# Altium schematic sheet DisplaySupplies.SchDoc
size 431 x 279 mm; Organization: ORGANIZATION; Address1: ADDRESS 1; Address2: ADDRESS 2; Address3: ADDRESS 3; Address4: ADDRESS 4; Revision: -; SheetNumber: 4; SheetTotal: 5; ENG_APP_DATE: --/--/--; DSN_APP_DATE: --/--/--; CHK_APP_DATE: --/--/--
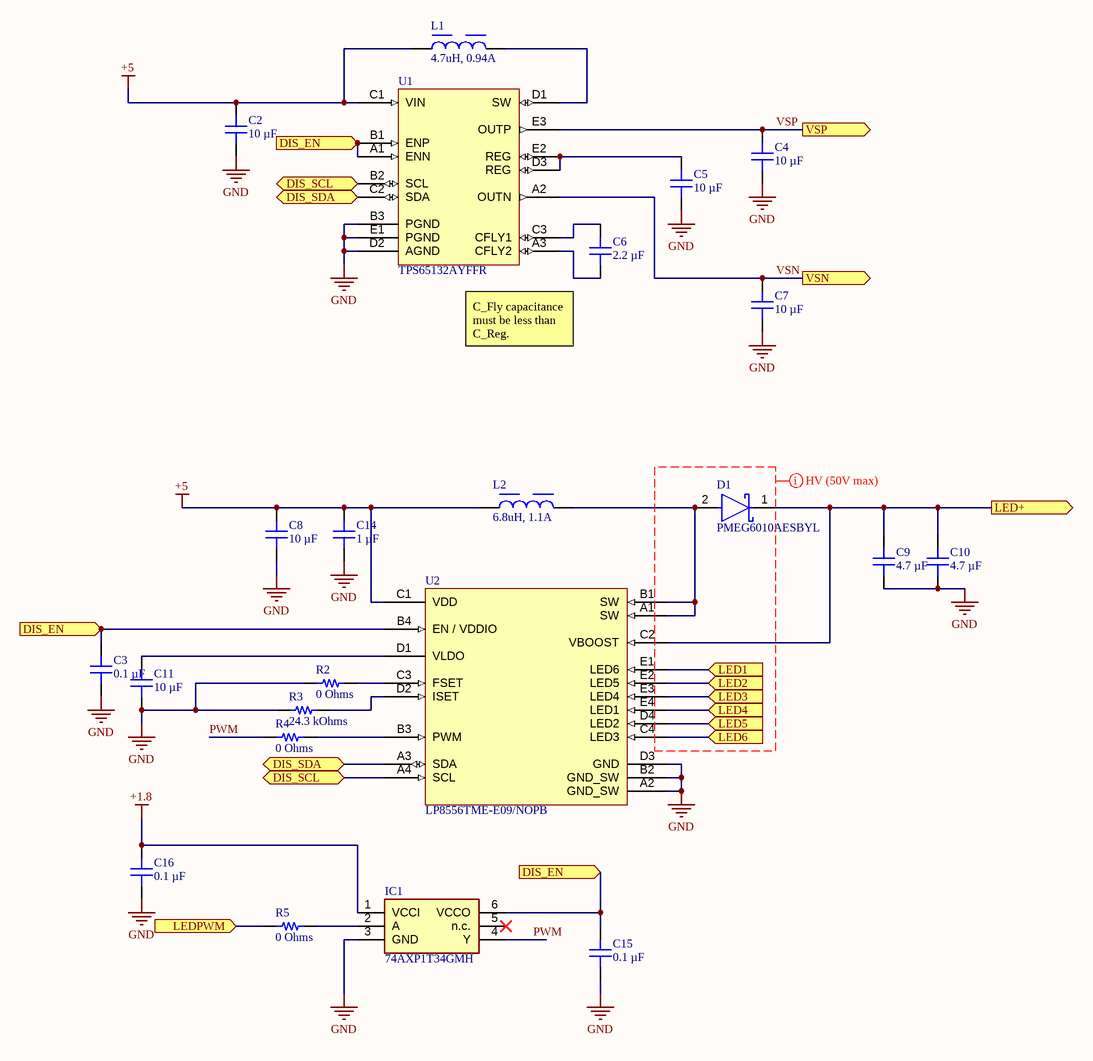
[diagram p0: DisplaySupplies.SchDoc]

## Parts
C2  10 µF  [CAP 0603_1608]
C3  0.1 µF  [CAP 0201_0603]
C4  10 µF  [CAP 0603_1608]
C5  10 µF  [CAP 0603_1608]
C6  2.2 µF  [CAP 0402_1005]
C7  10 µF  [CAP 0603_1608]
C8  10 µF  [CAP 0603_1608]
C9  4.7 µF  [CAP 1206_3216 - 0.8MM]
C10  4.7 µF  [CAP 1206_3216 - 0.8MM]
C11  10 µF  [CAP 0603_1608]
C14  1 µF  [CAP 0402_1005]
C15  0.1 µF  [CAP 0201_0603]
C16  0.1 µF  [CAP 0201_0603]
D1  PMEG6010AESBYL  [FP-SOD993-MFG]
IC1  74AXP1T34GMH  [PESD3V3L5UF115]
L1  4.7uH, 0.94A  [WE-MAPI_2510]
L2  6.8uH, 1.1A  [WE-MAPI_3015]
R2  0 Ohms  [RES 0402_1005]
R3  24.3 kOhms  [RES 0402_1005]
R4  0 Ohms  [RES 0402_1005]
R5  0 Ohms  [RES 0402_1005]
U1  TPS65132AYFFR  [BGA15C40P3X5_151X211X62]
U2  LP8556TME-E09/NOPB  [BGA20C40P4X5_171X237X68]

## Ports
DIS_EN (in), DIS_SCL (bidir), DIS_SDA (bidir), LED1 (in), LED2 (in), LED3 (in), LED4 (in), LED5 (in), LED6 (in), LED+ (out), LEDPWM (in), VSN (out), VSP (out)

## Nets
+1.8: C16.2 IC1.1(VCCI)
+5: C2.2 C8.2 C14.2 L1.1 L2.1 U1.C1(VIN) U2.C1(VDD)
GND: C2.1 C3.1 C4.1 C5.1 C7.1 C8.1 C9.1 C10.1 C11.1 C14.1 C15.1 C16.1 IC1.3(GND) R2.2 R3.2 U1.B3(PGND) U1.D2(AGND) U1.E1(PGND) U2.A2(GND_SW) U2.B2(GND_SW) U2.D3(GND)
DIS_EN: C3.2 C15.2 IC1.6(VCCO) U1.A1(ENN) U1.B1(ENP) U2.B4(EN_/_VDDIO) ; port DIS_EN
DIS_SCL: U1.B2(SCL) U2.A4(SCL) ; port DIS_SCL
DIS_SDA: U1.C2(SDA) U2.A3(SDA) ; port DIS_SDA
LED1: U2.E1(LED6) ; port LED1
LED2: U2.E2(LED5) ; port LED2
LED3: U2.E3(LED4) ; port LED3
LED4: U2.E4(LED1) ; port LED4
LED5: U2.D4(LED2) ; port LED5
LED6: U2.C4(LED3) ; port LED6
LED+: C9.2 C10.2 D1.1(K) U2.C2(VBOOST) ; port LED+
LEDPWM: R5.2 ; port LEDPWM
PWM: IC1.4(Y) R4.2
VSN: C7.2 U1.A2(OUTN) ; port VSN
VSP: C4.2 U1.E3(OUTP) ; port VSP
NetC5_2: C5.2 U1.D3(REG) U1.E2(REG)
NetC6_1: C6.1 U1.A3(CFLY2)
NetC6_2: C6.2 U1.C3(CFLY1)
NetC11_2: C11.2 U2.D1(VLDO)
NetD1_2: D1.2(A) L2.2 U2.A1(SW) U2.B1(SW)
NetIC1_2: IC1.2(A) R5.1
NetL1_2: L1.2 U1.D1(SW)
NetR2_1: R2.1 U2.C3(FSET)
NetR3_1: R3.1 U2.D2(ISET)
NetR4_1: R4.1 U2.B3(PWM)

Not connected (* = marked no-connect by the designer): IC1 5(n.c.)*

## Layout directives
net class HV: (no net found under the mark)

## Notes on the sheet
- C_Fly capacitance must be less than C_Reg.
- DWG. NO.
- REV.
- SHT.
- REVISION
- DESCRIPTION
- DATE
- APPROVED
- ENG:
- APPROVALS
- PROJECT
- DSN:
- CHK:
- REFERENCE DOCUMENTS
- PROJECT REVISION:
- TITLE
- SimulaVR
- DOCUMENT REVISION:
- DESIGN ITEM:
- BOM:
- FAB DWG:
- PCB DWG:
- ASSY DWG:
- SCALE:
- SIZE
- B
- CAGE CODE
- FILE NAME
- DWG NO.
- SHEET
- OF
- REV

## Library data of the parts
C2 C4 C5 C7 C8 C11 = GRM188R61C106MA73D: CAP CER 10UF 16V X5R 0603; manufacturer: Murata Electronics; Tolerance: ±20%; Part Number: GRM188R61C106MA73D; Value: 10 µF; Applications: General Purpose; Capacitance: 10 µF; componentlink1description: Datasheet; componentlink1url: https://www.murata.com/~/media/webrenewal/support/library/catalog/products/capacitor/mlcc/c02e.ashx?la=en-us; componentlink2description: DigiKey Link; componentlink2url: https://www.digikey.com/en/products/detail/murata-electronics/GRM188R61C106MA73D/3900480; Device Package: 0603 (1608 Metric); lastupdated: 2022-04-02 05:55:00; Lifecycle Status: Active; Minimum Order: 1; Mounting Type: Surface Mount, MLCC; Operating Temperature: -55°C ~ 85°C; Package / Case: 0603 (1608 Metric); packaging: TapeAndReel; partid: 15141; Part Status: Active; price: 0.04; series: GRM; Size / Dimension: 0.063" L x 0.031" W (1.60mm x 0.80mm); Supplier 1: DigiKey; Supplier Part Number 1: 490-7201-1-ND; Temperature Coefficient: X5R; Thickness (Max): 0.039" (1.00mm); Voltage - Rated: 16V
C3 C15 C16 = GRM033R61A104KE15D: CAP CER 0.1UF 10V X5R 0201; manufacturer: Murata Electronics; Tolerance: ±10%; Part Number: GRM033R61A104KE15D; Value: 0.1 µF; Applications: General Purpose; Capacitance: 0.1 µF; componentlink1description: Datasheet; componentlink1url: https://www.murata.com/~/media/webrenewal/support/library/catalog/products/capacitor/mlcc/c02e.ashx?la=en-us; componentlink2description: DigiKey Link; componentlink2url: https://www.digikey.com/en/products/detail/murata-electronics/GRM033R61A104KE15D/2269163; Device Package: 0201 (0603 Metric); lastupdated: 2022-04-12 22:01:55; Lifecycle Status: Active; Minimum Order: 1; Mounting Type: Surface Mount, MLCC; Operating Temperature: -55°C ~ 85°C; Package / Case: 0201 (0603 Metric); packaging: CutTape; partid: 1641; Part Status: Active; price: 0.01; series: GRM; Size / Dimension: 0.024" L x 0.012" W (0.60mm x 0.30mm); Supplier 1: DigiKey; Supplier Part Number 1: 490-5881-1-ND; Temperature Coefficient: X5R; Thickness (Max): 0.013" (0.33mm); Voltage - Rated: 10V
C6 = GRM155R61C225ME44D: CAP CER 2.2UF 16V X5R 0402; manufacturer: Murata Electronics; Tolerance: ±20%; Part Number: GRM155R61C225ME44D; Value: 2.2 µF; Applications: General Purpose; Capacitance: 2.2 µF; componentlink1description: Datasheet; componentlink1url: https://search.murata.co.jp/Ceramy/image/img/A01X/G101/ENG/GRM155R61C225ME44-01.pdf; componentlink2description: DigiKey Link; componentlink2url: https://www.digikey.com/en/products/detail/murata-electronics/GRM155R61C225ME44D/5027541; Device Package: 0402 (1005 Metric); lastupdated: 2022-04-02 05:51:52; Lifecycle Status: Active; Minimum Order: 1; Mounting Type: Surface Mount, MLCC; Operating Temperature: -55°C ~ 85°C; Package / Case: 0402 (1005 Metric); packaging: TapeAndReel; partid: 4092; Part Status: Active; price: 0.03; series: GRM; Size / Dimension: 0.039" L x 0.020" W (1.00mm x 0.50mm); Supplier 1: DigiKey; Supplier Part Number 1: 490-10456-1-ND; Temperature Coefficient: X5R; Thickness (Max): 0.024" (0.60mm); Voltage - Rated: 16V
C9 C10 = GRM31CR71H475KA12L: CAP CER 4.7UF 50V X7R 1206; manufacturer: Murata Electronics; Tolerance: ±10%; Part Number: GRM31CR71H475KA12L; Value: 4.7 µF; Applications: General Purpose; Capacitance: 4.7 µF; componentlink1description: Datasheet; componentlink1url: https://www.murata.com/~/media/webrenewal/support/library/catalog/products/capacitor/mlcc/c02e.ashx?la=en-us; componentlink2description: DigiKey Link; componentlink2url: https://www.digikey.com/en/products/detail/murata-electronics/GRM31CR71H475KA12L/2548209; Device Package: 1206 (3216 Metric); lastupdated: 2022-04-02 06:00:47; Lifecycle Status: Active; Minimum Order: 1; Mounting Type: Surface Mount, MLCC; Operating Temperature: -55°C ~ 125°C; Package / Case: 1206 (3216 Metric); packaging: TapeAndReel; partid: 20010; Part Status: Active; price: 0.08; series: GRM; Size / Dimension: 0.126" L x 0.063" W (3.20mm x 1.60mm); Supplier 1: DigiKey; Supplier Part Number 1: 490-6521-1-ND; Temperature Coefficient: X7R; Thickness (Max): 0.071" (1.80mm); Voltage - Rated: 50V
C14 = GRM155R61C105MA12D: CAP CER 1UF 16V X5R 0402; manufacturer: Murata Electronics; Tolerance: ±20%; Part Number: GRM155R61C105MA12D; Value: 1 µF; Applications: General Purpose; Capacitance: 1 µF; componentlink1description: Datasheet; componentlink1url: https://search.murata.co.jp/Ceramy/image/img/A01X/G101/ENG/GRM155R61C105MA12-01.pdf; componentlink2description: DigiKey Link; componentlink2url: https://www.digikey.com/en/products/detail/murata-electronics/GRM155R61C105MA12D/4905131; Device Package: 0402 (1005 Metric); lastupdated: 2022-04-02 05:51:33; Lifecycle Status: Active; Minimum Order: 1; Mounting Type: Surface Mount, MLCC; Operating Temperature: -55°C ~ 85°C; Package / Case: 0402 (1005 Metric); packaging: TapeAndReel; partid: 10295; Part Status: Active; price: 0.01; series: GRM; Size / Dimension: 0.039" L x 0.020" W (1.00mm x 0.50mm); Supplier 1: DigiKey; Supplier Part Number 1: 490-14599-1-ND; Temperature Coefficient: X5R; Thickness (Max): 0.022" (0.55mm); Voltage - Rated: 16V
D1 = CMP-14398-000012-1: DIODE SCHOTTKY 60V 1A DSN1006-2
IC1 = 74AXP1T34GMH: Integrated Circuit; Manufacturer_Name: Nexperia; Datasheet Link: https://assets.nexperia.com/documents/data-sheet/74AXP1T34.pdf; Height: 0.5mm; Manufacturer_Part_Number: 74AXP1T34GMH; Mouser Part Number: 771-74AXP1T34GMH; Mouser Price/Stock: https://www.mouser.co.uk/ProductDetail/Nexperia/74AXP1T34GMH?qs=64Y9EYqwa9hz4MxtKQGkpQ%3D%3D; Arrow Part Number: 74AXP1T34GMH; Arrow Price/Stock: https://www.arrow.com/en/products/74axp1t34gmh/nexperia
L1 = 74438323047: WE-MAPI SMT Power Inductor, size 2510, 4.7uH, 0.94A; Manufacturer: Wurth Elektronik; DC Resistance typ.: 338mOhm; DC Resistance max.: 388mOhm; Self Resonant Frequency: 35MHz; Saturation Current: 1.75A; ComponentLink1Description: Manufacturer; ComponentLink1URL: http://www.we-online.de; ComponentLink2Description: Datasheet; ComponentLink2URL: https://www.we-online.com/catalog/datasheet/74438323047.pdf; Mounting Technology: SMT; Operating Temperature: -40 to +125degC; Packaging: Tape and Reel; Size: 2510; Inductance: 4.7uH; Manufacturer Part Number: 74438323047; Rated Current: 0.94A; Height: 1mm; Length: 2.5mm; Width: 2mm
L2 = 74438335068: WE-MAPI SMT Power Inductor, size 3015, 6.8uH, 1.1A; Manufacturer: Wurth Elektronik; DC Resistance typ.: 250mOhm; DC Resistance max.: 287mOhm; Self Resonant Frequency: 25MHz; Saturation Current: 2.4A; ComponentLink1Description: Manufacturer; ComponentLink1URL: http://www.we-online.de; ComponentLink2Description: Datasheet; ComponentLink2URL: https://www.we-online.com/catalog/datasheet/74438335068.pdf; Mounting Technology: SMT; Operating Temperature: -40 to +125degC; Packaging: Tape and Reel; Size: 3015; Inductance: 6.8uH; Manufacturer Part Number: 74438335068; Rated Current: 1.1A; Height: 1.5mm; Length: 3mm; Width: 3mm
R2 R4 R5 = CRCW04020000Z0EDHP: RES SMD 0 OHM JUMPER 1/5W 0402; Manufacturer: Vishay Dale; Power (Watts): 0.2W, 1/5W; Part Number: CRCW04020000Z0EDHP; Value: 0 Ohms; ComponentLink1Description: Datasheet; ComponentLink1URL: http://www.vishay.com/docs/20043/crcwhpe3.pdf; ComponentLink2Description: DigiKey Link; ComponentLink2URL: http://digikey.com/product-detail/en/vishay-dale/CRCW04020000Z0EDHP/541-0.0YBCT-ND/2223008; Composition: Thick Film; Device Package: 0402 (1005 Metric); Features: Automotive AEC-Q200, Pulse Withstanding; Height - Seated (Max): 0.016" (0.40mm); LastUpdated: 2022-04-02 06:08:09; Lifecycle Status: Active; Minimum Order: 1; Number of Terminations: 2; Operating Temperature: -55°C ~ 155°C; Package / Case: 0402 (1005 Metric); Packaging: TapeAndReel; PartId: 3131; Part Status: Active; Price: 0.01; Ratings: AEC-Q200; Resistance: 0 Ohms; Series: CRCW-HP; Size / Dimension: 0.039" L x 0.020" W (1.00mm x 0.50mm); Supplier 1: DigiKey; Supplier Part Number 1: 541-0.0YBCT-ND; Supplier Device Package: 0402; Tolerance: Jumper
R3 = RC0402FR-0724K3L: RES 24.3K OHM 1% 1/16W 0402; Manufacturer: Yageo; Power (Watts): 0.063W, 1/16W; Temperature Coefficient: ±100ppm/°C; Part Number: RC0402FR-0724K3L; Value: 24.3 kOhms; ComponentLink1Description: Datasheet; ComponentLink1URL: https://www.yageo.com/upload/media/product/productsearch/datasheet/rchip/PYu-RC_Group_51_RoHS_L_10.pdf; ComponentLink2Description: DigiKey Link; ComponentLink2URL: https://www.digikey.com/en/products/detail/yageo/RC0402FR-0724K3L/5280931; Composition: Thick Film; Device Package: 0402 (1005 Metric); Features: Moisture Resistant; Height - Seated (Max): 0.016" (0.40mm); LastUpdated: 2022-04-02 06:08:10; Lifecycle Status: Active; Minimum Order: 1; Number of Terminations: 2; Operating Temperature: -55°C ~ 155°C; Package / Case: 0402 (1005 Metric); Packaging: CutTape; PartId: 2738; Part Status: Active; Price: 0.01; Resistance: 24.3 kOhms; Series: RC_L; Size / Dimension: 0.039" L x 0.020" W (1.00mm x 0.50mm); Supplier 1: DigiKey; Supplier Part Number 1: YAG3071CT-ND; Supplier Device Package: 0402; Tolerance: ±1%
U1 = CMP-019-00049-2: Split-Rail, Single Inductor Dual Output Converter with Positive and Negative Outputs 15-DSBGA -40 to 85
U2 = CMP-019-00051-2: 6 channel high-efficiency/Efficacy LED backlight driver 20-DSBGA -30 to 85